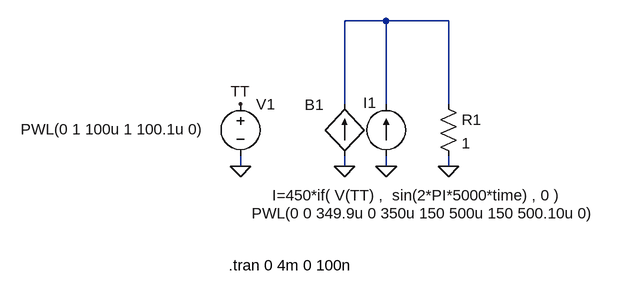
[diagram p0: schematic Problem_3.asc]
Problem_3.asc, the LTspice schematic file:
Version 4
SHEET 1 880 680
WIRE 240 0 176 0
WIRE 336 0 240 0
WIRE 176 128 176 0
WIRE 240 128 240 0
WIRE 336 128 336 0
WIRE 16 224 16 208
WIRE 176 224 176 208
WIRE 240 224 240 208
WIRE 336 224 336 208
FLAG 176 224 0
FLAG 336 224 0
FLAG 16 224 0
FLAG 16 128 TT
FLAG 240 224 0
SYMBOL res 320 112 R0
SYMATTR InstName R1
SYMATTR Value 1
SYMBOL bi 176 208 R180
WINDOW 0 32 79 Left 2
WINDOW 3 -334 -60 Left 2
SYMATTR InstName B1
SYMATTR Value I=450*if( V(TT) ,  sin(2*PI*5000*time) , 0 )
SYMBOL voltage 16 112 R0
WINDOW 3 -338 55 Left 2
WINDOW 123 0 0 Left 0
WINDOW 39 0 0 Left 0
SYMATTR InstName V1
SYMATTR Value PWL(0 1 100u 1 100.1u 0)
SYMBOL current 240 208 R180
WINDOW 0 15 82 Left 2
WINDOW 3 -327 -88 Left 2
WINDOW 123 0 0 Left 0
WINDOW 39 0 0 Left 0
SYMATTR InstName I1
SYMATTR Value PWL(0 0 349.9u 0 350u 150 500u 150 500.10u 0)
TEXT -2 376 Left 2 !.tran 0 4m 0 100n

The netlist it stands for:
* Problem_3.asc
R1 N001 0 1
B1 0 N001 I=450*if( V(TT) ,  sin(2*PI*5000*time) , 0 )
V1 TT 0 PWL(0 1 100u 1 100.1u 0)
I1 0 N001 PWL(0 0 349.9u 0 350u 150 500u 150 500.10u 0)
.tran 0 4m 0 100n
.backanno
.end